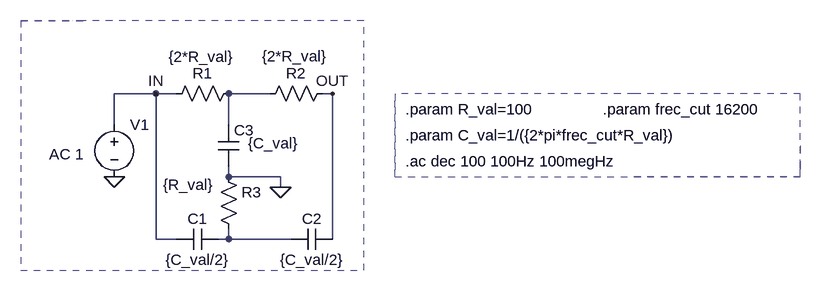
[diagram p0: schematic TP1.asc]
TP1.asc, the LTspice schematic file:
Version 4
SHEET 1 1092 680
WIRE 96 96 32 96
WIRE 128 96 96 96
WIRE 272 96 208 96
WIRE 368 96 352 96
WIRE 32 144 32 96
WIRE 208 144 208 96
WIRE 208 224 208 208
WIRE 288 224 208 224
WIRE 288 240 288 224
WIRE 96 320 96 96
WIRE 128 320 96 320
WIRE 208 320 208 304
WIRE 208 320 192 320
WIRE 304 320 208 320
WIRE 368 320 368 96
FLAG 288 240 0
FLAG 32 224 0
FLAG 368 96 OUT
FLAG 96 96 IN
SYMBOL cap 192 304 R90
WINDOW 0 0 32 VBottom 2
WINDOW 3 32 32 VTop 2
SYMATTR InstName C1
SYMATTR Value {C_val/2}
SYMBOL res 224 80 R90
WINDOW 0 0 56 VBottom 2
WINDOW 3 -56 58 VTop 2
SYMATTR InstName R1
SYMATTR Value {2*R_val}
SYMBOL cap 192 144 R0
WINDOW 3 46 28 Left 2
SYMATTR Value {C_val}
SYMATTR InstName C3
SYMBOL res 192 208 R0
WINDOW 3 -85 28 Left 2
SYMATTR Value {R_val}
SYMATTR InstName R3
SYMBOL res 368 80 R90
WINDOW 0 0 56 VBottom 2
WINDOW 3 -57 58 VTop 2
SYMATTR InstName R2
SYMATTR Value {2*R_val}
SYMBOL cap 368 304 R90
WINDOW 0 0 32 VBottom 2
WINDOW 3 32 32 VTop 2
SYMATTR InstName C2
SYMATTR Value {C_val/2}
SYMBOL voltage 32 128 R0
WINDOW 123 -100 61 Left 2
WINDOW 39 0 0 Left 0
WINDOW 3 -311 58 Left 2
SYMATTR Value2 AC 1
SYMATTR Value ""
SYMATTR InstName V1
TEXT 480 120 Left 2 !.param R_val=100
TEXT 480 200 Left 2 !.ac dec 100 100Hz 100megHz
TEXT 480 160 Left 2 !.param C_val=1/({2*pi*frec_cut*R_val})
TEXT 784 120 Left 2 !.param frec_cut 16200
LINE Normal 832 96 464 96 2
LINE Normal 464 224 832 224 1
LINE Normal 464 224 464 224 2
LINE Normal 464 96 464 224 2
LINE Normal 464 96 464 96 2
LINE Normal 464 224 464 96 2
LINE Normal -32 -16 -32 -16 2
LINE Normal 416 -16 -32 -16 2
LINE Normal 416 368 416 -16 2
LINE Normal -32 368 416 368 2
LINE Normal -112 368 -32 368 2
LINE Normal -112 -16 -112 368 2
LINE Normal -16 -16 -112 -16 2
LINE Normal -112 -16 -16 -16 2
LINE Normal 1088 96 832 96 2
LINE Normal 1088 208 1088 96 2
LINE Normal 1088 208 1088 208 2
LINE Normal 1088 224 1088 208 2
LINE Normal 832 224 1088 224 2
LINE Normal 1088 224 832 224 2
LINE Normal 1088 224 1088 224 2
LINE Normal 1088 176 1088 224 2

The netlist it stands for:
* TP1.asc
C1 N002 IN {C_val/2}
R1 N001 IN {2*R_val}
C3 N001 0 {C_val}
R3 0 N002 {R_val}
R2 OUT N001 {2*R_val}
C2 OUT N002 {C_val/2}
V1 IN 0 AC 1
.param R_val=100
.ac dec 100 100Hz 100megHz
.param C_val=1/({2*pi*frec_cut*R_val})
.param frec_cut 16200
.backanno
.end